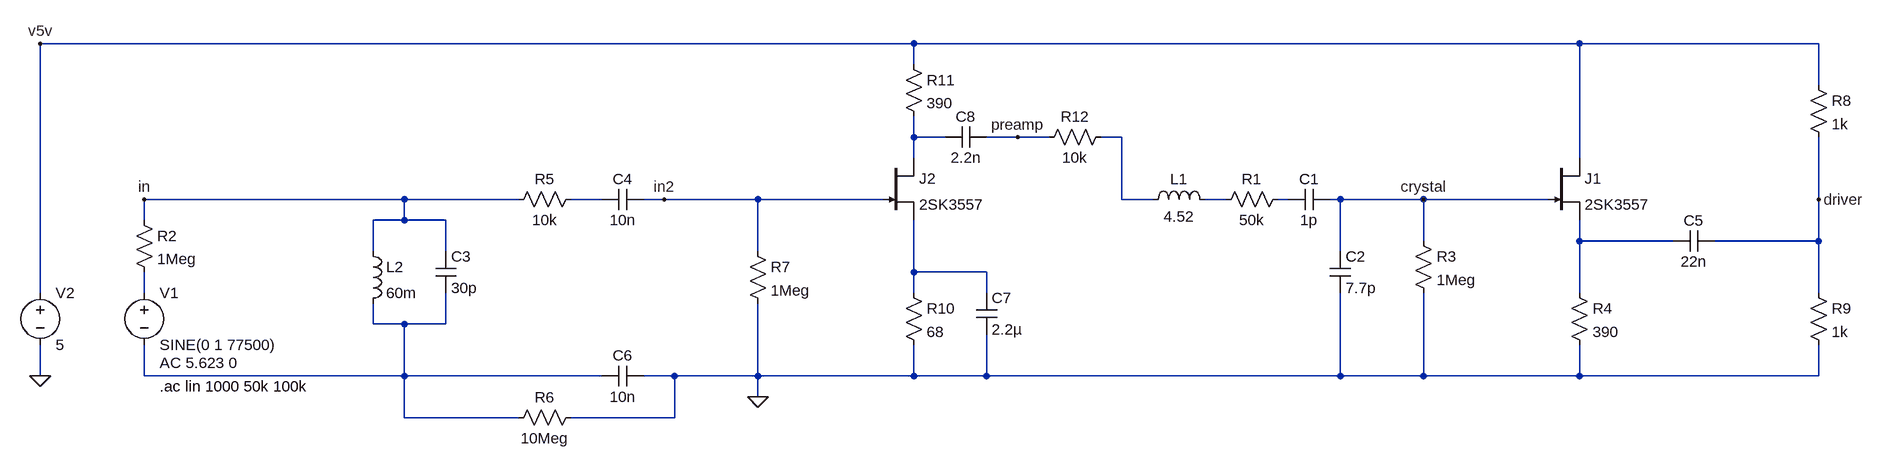
[diagram p0: schematic 03_nFET_and_Crystal_and_nFET_AC-analysis.asc]
03_nFET_and_Crystal_and_nFET_AC-analysis.asc, the LTspice schematic file:
Version 4
SHEET 1 1192 680
WIRE -320 -224 -1664 -224
WIRE 704 -224 -320 -224
WIRE 1072 -224 704 -224
WIRE -320 -192 -320 -224
WIRE 1072 -160 1072 -224
WIRE -320 -80 -320 -112
WIRE -272 -80 -320 -80
WIRE -160 -80 -208 -80
WIRE -112 -80 -160 -80
WIRE 0 -80 -32 -80
WIRE -320 -48 -320 -80
WIRE 704 -48 704 -224
WIRE -1104 16 -1504 16
WIRE -928 16 -1104 16
WIRE -800 16 -848 16
WIRE -704 16 -736 16
WIRE -560 16 -704 16
WIRE -368 16 -560 16
WIRE 0 16 0 -80
WIRE 48 16 0 16
WIRE 160 16 128 16
WIRE 256 16 240 16
WIRE 336 16 320 16
WIRE 464 16 336 16
WIRE 656 16 464 16
WIRE 1072 16 1072 -80
WIRE -1504 48 -1504 16
WIRE -1104 48 -1104 16
WIRE -1104 48 -1152 48
WIRE -1040 48 -1104 48
WIRE 464 80 464 16
WIRE 704 80 704 48
WIRE 848 80 704 80
WIRE 1072 80 1072 16
WIRE 1072 80 912 80
WIRE -1152 96 -1152 48
WIRE -1040 96 -1040 48
WIRE -560 96 -560 16
WIRE 336 96 336 16
WIRE -320 128 -320 48
WIRE -208 128 -320 128
WIRE -1664 160 -1664 -224
WIRE -1504 160 -1504 128
WIRE -320 160 -320 128
WIRE -208 160 -208 128
WIRE 704 160 704 80
WIRE 1072 160 1072 80
WIRE -1152 208 -1152 176
WIRE -1104 208 -1152 208
WIRE -1040 208 -1040 160
WIRE -1040 208 -1104 208
WIRE -1664 288 -1664 240
WIRE -1504 288 -1504 240
WIRE -1104 288 -1104 208
WIRE -1104 288 -1504 288
WIRE -800 288 -1104 288
WIRE -688 288 -736 288
WIRE -560 288 -560 176
WIRE -560 288 -688 288
WIRE -320 288 -320 240
WIRE -320 288 -560 288
WIRE -208 288 -208 224
WIRE -208 288 -320 288
WIRE 336 288 336 160
WIRE 336 288 -208 288
WIRE 464 288 464 160
WIRE 464 288 336 288
WIRE 704 288 704 240
WIRE 704 288 464 288
WIRE 1072 288 1072 240
WIRE 1072 288 704 288
WIRE -560 320 -560 288
WIRE -1104 352 -1104 288
WIRE -928 352 -1104 352
WIRE -688 352 -688 288
WIRE -688 352 -848 352
FLAG 464 16 crystal
FLAG -1504 16 in
FLAG -1664 288 0
FLAG -1664 -224 v5v
FLAG 1072 16 driver
FLAG -560 320 0
FLAG -704 16 in2
FLAG -160 -80 preamp
SYMBOL ind 32 32 R270
WINDOW 0 32 56 VTop 2
WINDOW 3 5 56 VBottom 2
SYMATTR InstName L1
SYMATTR Value 4.52
SYMBOL cap 320 0 R90
WINDOW 0 0 32 VBottom 2
WINDOW 3 32 32 VTop 2
SYMATTR InstName C1
SYMATTR Value 1p
SYMBOL res 256 0 R90
WINDOW 0 0 56 VBottom 2
WINDOW 3 32 56 VTop 2
SYMATTR InstName R1
SYMATTR Value 50k
SYMBOL voltage -1504 144 R0
WINDOW 123 24 124 Left 2
WINDOW 39 0 0 Left 0
SYMATTR Value2 AC 5.623 0
SYMATTR InstName V1
SYMATTR Value SINE(0 1 77500)
SYMBOL res -1520 32 R0
SYMATTR InstName R2
SYMATTR Value 1Meg
SYMBOL res 448 64 R0
SYMATTR InstName R3
SYMATTR Value 1Meg
SYMBOL cap 320 96 R0
SYMATTR InstName C2
SYMATTR Value 7.7p
SYMBOL res 688 144 R0
SYMATTR InstName R4
SYMATTR Value 390
SYMBOL voltage -1664 144 R0
WINDOW 123 0 0 Left 0
WINDOW 39 24 124 Left 2
SYMATTR InstName V2
SYMATTR Value 5
SYMBOL njf 656 -48 R0
SYMATTR InstName J1
SYMATTR Value 2SK3557
SYMBOL cap 912 64 R90
WINDOW 0 0 32 VBottom 2
WINDOW 3 32 32 VTop 2
SYMATTR InstName C5
SYMATTR Value 22n
SYMBOL res 1056 -176 R0
SYMATTR InstName R8
SYMATTR Value 1k
SYMBOL res 1056 144 R0
SYMATTR InstName R9
SYMATTR Value 1k
SYMBOL ind -1168 80 R0
SYMATTR InstName L2
SYMATTR Value 60m
SYMBOL cap -1056 96 R0
SYMATTR InstName C3
SYMATTR Value 30p
SYMBOL res -832 0 R90
WINDOW 0 0 56 VBottom 2
WINDOW 3 32 56 VTop 2
SYMATTR InstName R5
SYMATTR Value 10k
SYMBOL cap -736 0 R90
WINDOW 0 0 32 VBottom 2
WINDOW 3 32 32 VTop 2
SYMATTR InstName C4
SYMATTR Value 10n
SYMBOL cap -736 272 R90
WINDOW 0 0 32 VBottom 2
WINDOW 3 32 32 VTop 2
SYMATTR InstName C6
SYMATTR Value 10n
SYMBOL res -832 336 R90
WINDOW 0 0 56 VBottom 2
WINDOW 3 32 56 VTop 2
SYMATTR InstName R6
SYMATTR Value 10Meg
SYMBOL res -576 80 R0
SYMATTR InstName R7
SYMATTR Value 1Meg
SYMBOL res -336 144 R0
SYMATTR InstName R10
SYMATTR Value 68
SYMBOL cap -224 160 R0
SYMATTR InstName C7
SYMATTR Value 2.2µ
SYMBOL njf -368 -48 R0
SYMATTR InstName J2
SYMATTR Value 2SK3557
SYMBOL res -336 -208 R0
SYMATTR InstName R11
SYMATTR Value 390
SYMBOL cap -208 -96 R90
WINDOW 0 0 32 VBottom 2
WINDOW 3 32 32 VTop 2
SYMATTR InstName C8
SYMATTR Value 2.2n
SYMBOL res -16 -96 R90
WINDOW 0 0 56 VBottom 2
WINDOW 3 32 56 VTop 2
SYMATTR InstName R12
SYMATTR Value 10k
TEXT -1480 304 Left 2 !.ac lin 1000 50k 100k

The netlist it stands for:
* 03_nFET_and_Crystal_and_nFET_AC-analysis.asc
L1 N002 N004 4.52
C1 crystal N005 1p
R1 N005 N004 50k
V1 N008 N009 SINE(0 1 77500) AC 5.623 0
R2 in N008 1Meg
R3 crystal 0 1Meg
C2 crystal 0 7.7p
R4 N006 0 390
V2 v5v 0 5
J1 v5v crystal N006 2SK3557
C5 driver N006 22n
R8 v5v driver 1k
R9 driver 0 1k
L2 in N009 60m
C3 in N009 30p
R5 N003 in 10k
C4 in2 N003 10n
C6 0 N009 10n
R6 0 N009 10Meg
R7 in2 0 1Meg
R10 N007 0 68
C7 N007 0 2.2µ
J2 N001 in2 N007 2SK3557
R11 v5v N001 390
C8 preamp N001 2.2n
R12 N002 preamp 10k
.model NJF NJF
.model PJF PJF
.lib standard.jft
.ac lin 1000 50k 100k
.backanno
.end